# EAGLE schematic SteeringV2 - Archie (EAGLE 9.6.2)
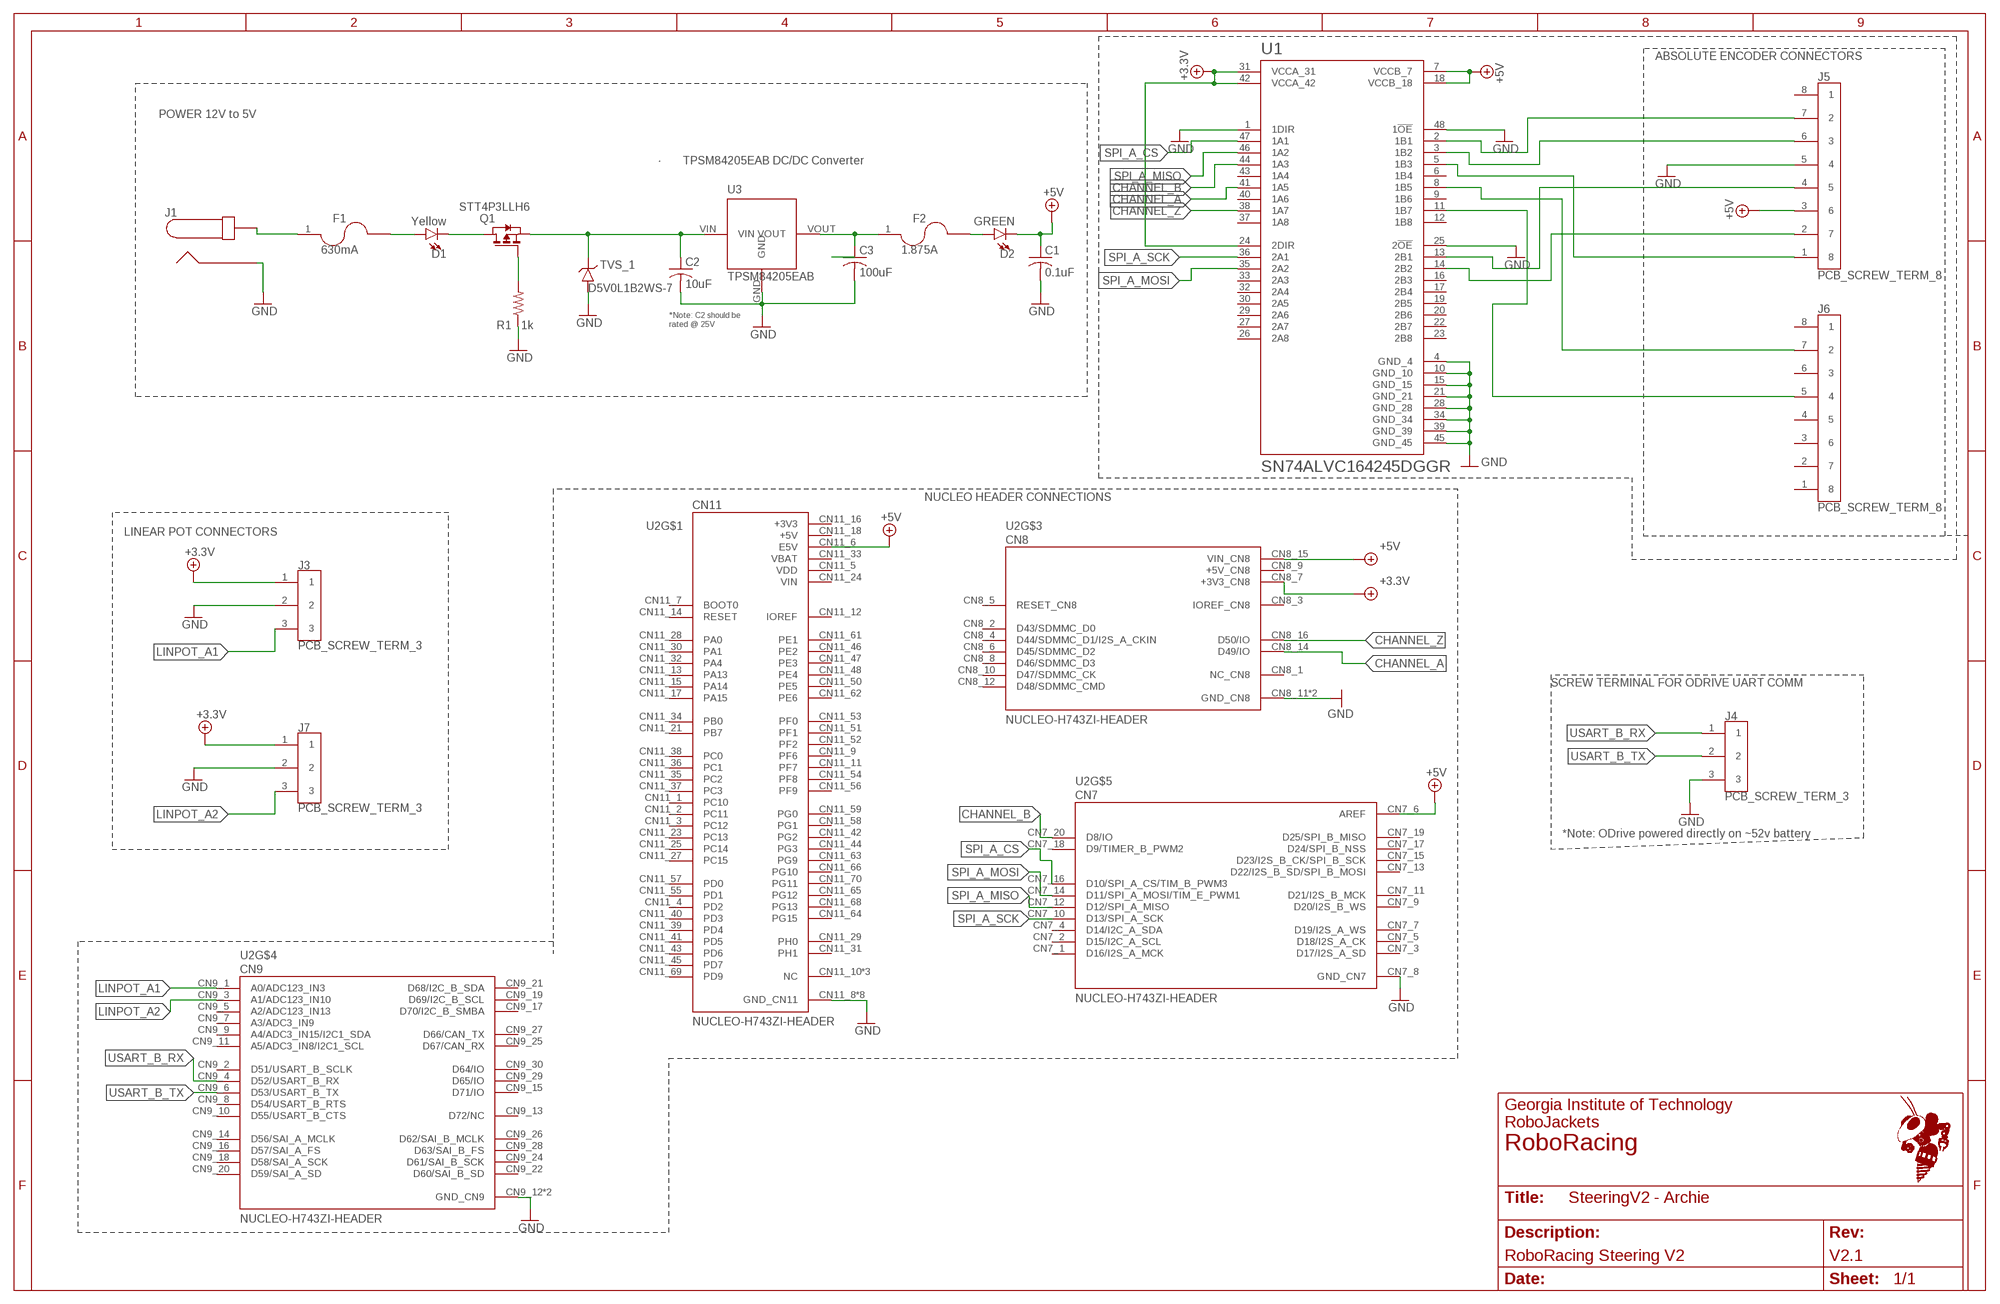
[diagram p0: schematic, sheet 1]
FRAME1 (FRAME_11_17): REVISION: V2.1; SCH_DESC: RoboRacing Steering V2; TEAM: RoboRacing

## Parts
C1  0.1uF  C-US025-024X044  [C025-024X044]
C2  10uF  C-US025-024X044  [C025-024X044]
C3  100uF  C-US025-024X044  [C025-024X044]
D1  Yellow  LED-YELLOW0603  [LED-0603]
D2  GREEN  LED-GREEN1206  [LED-1206]
F1  630mA  SMD_FUSE0603  [F0603]
F2  1.875A  SMD_FUSE0603  [F0603]
J1  PJ-037A  [PJ-037A]
J3  PCB_SCREW_TERM_3  [SCREW_TERMINAL_PCB_CONN_3_POLE]
J4  PCB_SCREW_TERM_3  [SCREW_TERMINAL_PCB_CONN_3_POLE]
J5  PCB_SCREW_TERM_8  [SCREW_TERMINAL_PCB_CONN_8_POLE]
J6  PCB_SCREW_TERM_8  [SCREW_TERMINAL_PCB_CONN_8_POLE]
J7  PCB_SCREW_TERM_3  [SCREW_TERMINAL_PCB_CONN_3_POLE]
Q1  STT4P3LLH6  [SOT23-6]
R1  1k  R-US_R0603  [R0603]
TVS_1  D5V0L1B2WS-7  [SOD-323]
U1  SN74ALVC164245DGGR  [SOP50P810X120-48N]
U2  NUCLEO-H743ZI-HEADER  [MODULE_NUCLEO-H743ZI]
U3  TPSM84205EAB  [TPSM84205EAB]

## Nets
5V_MAIN: C3.1 F2.1 U3.VOUT
+3.3V: J3.1 J7.1 U1.24(2DIR) U1.31(VCCA_31) U1.42(VCCA_42) U2.CN8_7(+3V3_CN8)
+5V: C1.1 D2.C J5.3 U1.7(VCCB_7) U1.18(VCCB_18) U2.CN7_6(AREF) U2.CN8_15(VIN_CN8) U2.CN11_6(E5V)
CHANNEL_A: J6.7 U1.8(1B5) U1.41(1A5) U2.CN8_14(D49/IO)
CHANNEL_B: J5.1 U1.5(1B3) U1.44(1A3) U2.CN7_20(D8/IO)
CHANNEL_Z: J6.5 U1.11(1B7) U1.38(1A7) U2.CN8_16(D50/IO)
GND: C1.2 C2.2 C3.2 J1.P$1 J3.2 J4.3 J5.5 J7.2 R1.1 TVS_1.A U1.1(1DIR) U1.4(GND_4) U1.10(GND_10) U1.15(GND_15) U1.21(GND_21) U1.25(2!OE) U1.28(GND_28) U1.34(GND_34) U1.39(GND_39) U1.45(GND_45) U1.48(1!OE) U2.CN7_8(GND_CN7) U2.CN8_11(GND_CN8) U2.CN8_13(GND_CN8) U2.CN9_12(GND_CN9) U2.CN9_23(GND_CN9) U2.CN11_8(GND_CN11) U2.CN11_19(GND_CN11) U2.CN11_20(GND_CN11) U2.CN11_22(GND_CN11) U2.CN11_49(GND_CN11) U2.CN11_60(GND_CN11) U2.CN11_71(GND_CN11) U2.CN11_72(GND_CN11) U3.GND
LINPOT_A1: J3.3 U2.CN9_1(A0/ADC123_IN3)
LINPOT_A2: J7.3 U2.CN9_3(A1/ADC123_IN10)
N$1: D1.A F1.2
N$2: Q1.3(G) R1.2
N$3: C2.1 Q1.4(S) TVS_1.C U3.VIN
N$4: F1.1 J1.P$2
N$6: D1.C Q1.1(D) Q1.2(D) Q1.5(D) Q1.6(D)
N$7: D2.A F2.2
SPI_A_CS: J5.7 U1.2(1B1) U1.47(1A1) U2.CN7_16(D10/SPI_A_CS/TIM_B_PWM3)
SPI_A_MISO: J5.6 U1.3(1B2) U1.46(1A2) U2.CN7_12(D12/SPI_A_MISO)
SPI_A_MOSI: J5.2 U1.14(2B2) U1.35(2A2) U2.CN7_14(D11/SPI_A_MOSI/TIM_E_PWM1)
SPI_A_SCK: J5.4 U1.13(2B1) U1.36(2A1) U2.CN7_10(D13/SPI_A_SCK)
USART_B_RX: J4.1 U2.CN9_4(D52/USART_B_RX)
USART_B_TX: J4.2 U2.CN9_6(D53/USART_B_TX)
Unconnected: J5.8 J6.1 J6.2 J6.3 J6.4 J6.6 J6.8 U1.6(1B4) U1.9(1B6) U1.12(1B8) U1.16(2B3) U1.17(2B4) U1.19(2B5) U1.20(2B6) U1.22(2B7) U1.23(2B8) U1.26(2A8) U1.27(2A7) U1.29(2A6) U1.30(2A5) U1.32(2A4) U1.33(2A3) U1.37(1A8) U1.40(1A6) U1.43(1A4) U2.CN7_1(D16/I2S_A_MCK) U2.CN7_2(D15/I2C_A_SCL) U2.CN7_3(D17/I2S_A_SD) U2.CN7_4(D14/I2C_A_SDA) U2.CN7_5(D18/I2S_A_CK) U2.CN7_7(D19/I2S_A_WS) U2.CN7_9(D20/I2S_B_WS) U2.CN7_11(D21/I2S_B_MCK) U2.CN7_13(D22/I2S_B_SD/SPI_B_MOSI) U2.CN7_15(D23/I2S_B_CK/SPI_B_SCK) U2.CN7_17(D24/SPI_B_NSS) U2.CN7_18(D9/TIMER_B_PWM2) U2.CN7_19(D25/SPI_B_MISO) U2.CN8_1(NC_CN8) U2.CN8_2(D43/SDMMC_D0) U2.CN8_3(IOREF_CN8) U2.CN8_4(D44/SDMMC_D1/I2S_A_CKIN) U2.CN8_5(RESET_CN8) U2.CN8_6(D45/SDMMC_D2) U2.CN8_8(D46/SDMMC_D3) U2.CN8_10(D47/SDMMC_CK) U2.CN8_12(D48/SDMMC_CMD) U2.CN9_2(D51/USART_B_SCLK) U2.CN9_5(A2/ADC123_IN13) U2.CN9_7(A3/ADC3_IN9) U2.CN9_8(D54/USART_B_RTS) U2.CN9_9(A4/ADC3_IN15/I2C1_SDA) U2.CN9_10(D55/USART_B_CTS) U2.CN9_11(A5/ADC3_IN8/I2C1_SCL) U2.CN9_13(D72/NC) U2.CN9_14(D56/SAI_A_MCLK) U2.CN9_15(D71/IO) U2.CN9_16(D57/SAI_A_FS) U2.CN9_17(D70/I2C_B_SMBA) U2.CN9_18(D58/SAI_A_SCK) U2.CN9_19(D69/I2C_B_SCL) U2.CN9_20(D59/SAI_A_SD) U2.CN9_21(D68/I2C_B_SDA) U2.CN9_22(D60/SAI_B_SD) U2.CN9_24(D61/SAI_B_SCK) U2.CN9_25(D67/CAN_RX) U2.CN9_26(D62/SAI_B_MCLK) U2.CN9_27(D66/CAN_TX) U2.CN9_28(D63/SAI_B_FS) U2.CN9_29(D65/IO) U2.CN9_30(D64/IO) U2.CN10_2(D7/IO) U2.CN10_4(D6/TIMER_A_PWM1) U2.CN10_6(D5/TIMER_A_PWM2) U2.CN10_7(A6/ADC_A_IN) U2.CN10_8(D4/IO) U2.CN10_9(A7/ADC_B_IN) U2.CN10_10(D3/TIMER_A_PWM3) U2.CN10_11(A8/ADC_C_IN) U2.CN10_12(D2/IO) U2.CN10_13(D26/IO) U2.CN10_14(D1/USART_A_TX) U2.CN10_15(D27/IO) U2.CN10_16(D0/USART_A_RX) U2.CN10_18(D42/TIMER_A_PWM1N) U2.CN10_19(D28/IO) U2.CN10_20(D41/TIMER_A_ETR) U2.CN10_21(D29/IO) U2.CN10_23(D30/IO) U2.CN10_24(D40/TIMER_A_PWM2N) U2.CN10_25(D31/IO) U2.CN10_26(D39/TIMER_A_PWM3N) U2.CN10_28(D38/IO) U2.CN10_29(D32/TIMER_C_PWM1) U2.CN10_30(D37/TIMER_A_BKIN1) U2.CN10_31(D33/TIMER_D_PWM1) U2.CN10_32(D36/TIMER_C_PWM2) U2.CN10_33(D34/TIMER_B_ETR) U2.CN10_34(D35/TIMER_C_PWM3) U2.CN11_1(PC10) U2.CN11_2(PC11) U2.CN11_3(PC12) U2.CN11_4(PD2) U2.CN11_7(BOOT0) U2.CN11_9(PF6) U2.CN11_10(NC) U2.CN11_11(PF7) U2.CN11_12(IOREF) U2.CN11_13(PA13) U2.CN11_14(RESET) U2.CN11_15(PA14) U2.CN11_17(PA15) U2.CN11_21(PB7) U2.CN11_23(PC13) U2.CN11_25(PC14) U2.CN11_26(NC) U2.CN11_27(PC15) U2.CN11_28(PA0) U2.CN11_29(PH0) U2.CN11_30(PA1) U2.CN11_31(PH1) U2.CN11_32(PA4) U2.CN11_34(PB0) U2.CN11_35(PC2) U2.CN11_36(PC1) U2.CN11_37(PC3) U2.CN11_38(PC0) U2.CN11_39(PD4) U2.CN11_40(PD3) U2.CN11_41(PD5) U2.CN11_42(PG2) U2.CN11_43(PD6) U2.CN11_44(PG3) U2.CN11_45(PD7) U2.CN11_46(PE2) U2.CN11_47(PE3) U2.CN11_48(PE4) U2.CN11_50(PE5) U2.CN11_51(PF1) U2.CN11_52(PF2) U2.CN11_53(PF0) U2.CN11_54(PF8) U2.CN11_55(PD1) U2.CN11_56(PF9) U2.CN11_57(PD0) U2.CN11_58(PG1) U2.CN11_59(PG0) U2.CN11_61(PE1) U2.CN11_62(PE6) U2.CN11_63(PG9) U2.CN11_64(PG15) U2.CN11_65(PG12) U2.CN11_66(PG10) U2.CN11_67(NC) U2.CN11_68(PG13) U2.CN11_69(PD9) U2.CN11_70(PG11) U2.CN12_1(PC9) U2.CN12_2(PC8) U2.CN12_3(PB8) U2.CN12_4(PC6) U2.CN12_5(PB9) U2.CN12_6(PC5) U2.CN12_10(PD8) U2.CN12_11(PA5) U2.CN12_12(PA12) U2.CN12_13(PA6) U2.CN12_14(PA11) U2.CN12_15(PA7) U2.CN12_16(PB12) U2.CN12_17(PB6) U2.CN12_18(PB11) U2.CN12_19(PC7) U2.CN12_21(PA9) U2.CN12_22(PB2) U2.CN12_23(PA8) U2.CN12_24(PB1) U2.CN12_25(PB10) U2.CN12_26(PB15) U2.CN12_27(PB4) U2.CN12_28(PB14) U2.CN12_29(PB5) U2.CN12_30(PB13) U2.CN12_31(PB3) U2.CN12_33(PA10) U2.CN12_34(PC4) U2.CN12_35(PA2) U2.CN12_36(PF5) U2.CN12_37(PA3) U2.CN12_38(PF4) U2.CN12_40(PE8) U2.CN12_41(PD13) U2.CN12_42(PF10) U2.CN12_43(PD12) U2.CN12_44(PE7) U2.CN12_45(PD11) U2.CN12_46(PD14) U2.CN12_47(PE10) U2.CN12_48(PD15) U2.CN12_49(PE12) U2.CN12_50(PF14) U2.CN12_51(PE14) U2.CN12_52(PE9) U2.CN12_53(PE15) U2.CN12_55(PE13) U2.CN12_56(PE11) U2.CN12_57(PF13) U2.CN12_58(PF3) U2.CN12_59(PF12) U2.CN12_60(PF15) U2.CN12_61(PG14) U2.CN12_62(PF11) U2.CN12_64(PE0) U2.CN12_65(PD10) U2.CN12_66(PG8) U2.CN12_67(PG7) U2.CN12_68(PG5) U2.CN12_69(PG4) U2.CN12_70(PG6)

## Notes on the sheet
- ABSOLUTE ENCODER CONNECTORS
- POWER 12V to 5V
- ·       TPSM84205EAB DC/DC Converter
- *Note: C2 should be
  rated @ 25V
- NUCLEO HEADER CONNECTIONS
- LINEAR POT CONNECTORS
- SCREW TERMINAL FOR ODRIVE UART COMM
- *Note: ODrive powered directly on ~52v battery

## Power pins joined to a net without a drawn wire
+3V3: U2.CN11_16(+3V3)
+5V: U2.CN11_18(+5V)
+5V_CN8: U2.CN8_9(+5V_CN8)
AGND_CN10: U2.CN10_3(AGND_CN10)
AGND_CN12: U2.CN12_32(AGND_CN12)
AVDD_CN10: U2.CN10_1(AVDD_CN10)
AVDD_CN12: U2.CN12_7(AVDD_CN12)
GND_CN10: U2.CN10_5(GND_CN10) U2.CN10_17(GND_CN10) U2.CN10_22(GND_CN10) U2.CN10_27(GND_CN10)
GND_CN12: U2.CN12_9(GND_CN12) U2.CN12_20(GND_CN12) U2.CN12_39(GND_CN12) U2.CN12_54(GND_CN12) U2.CN12_63(GND_CN12) U2.CN12_71(GND_CN12) U2.CN12_72(GND_CN12)
U5V: U2.CN12_8(U5V)
VBAT: U2.CN11_33(VBAT)
VDD: U2.CN11_5(VDD)
VIN: U2.CN11_24(VIN)

## Library data of the parts
C1-C3 = rcl:C-US: CAPACITOR, American symbol; SPICEPREFIX: C
D1 = RoboJackets-LEDs:LED-YELLOW: Yellow SMD LED Used in manufacturing several products at SparkFun. Packages: 0603 - SMD 0603 package[Product Link] <http://www.kingbrightusa.com/product.asp?catalog_name=LED&product_id=APT1608SYCK> 0603 -SMART - SMART SMD 0603 package (more efficient/more expensive) [Product Link] <http://www.osram-os.com/osram_os/en/products/product-catalog/led-light-emitting-diodes/smartled-0603/ly-l29k/index.jsp> LilyPad - SMD1206 package[Product Datasheet] <https://www.sparkfun.com/datasheets/DevTools/LilyPad/Q150YUS4.pdf> SparkFun Products: Blynk Board <https://www.sparkfun.com/products/13794> IOIO-OTG <https://www.sparkfun.com/products/13613> XBee Explorer Serial <https://www.sparkfun.com/products/13225>; PROD_ID: DIO-09003
D2 = RoboJackets-LEDs:LED-GREEN: Green SMD LED Used in manufacturing of various products at SparkFun Packages: 0603 - SMD 0603 package [Product Link] <http://www.futureelectronics.com/en/technologies/semiconductors/optoelectronics/leds/Pages/9894312-LTST-C190GKT.aspx?CrossPart=HSMG-C190&IM=0> LilyPad 1206 - SMD1206 LilyPad package [Product Link] <http://www.futureelectronics.com/en/Technologies/Product.aspx?ProductID=IN150NGHARVATEKCORPORATION2049943&IM=0> 1206 - SMD1206 package [Product Link] <http://www.futureelectronics.com/en/technologies/semiconductors/optoelectronics/leds/Pages/8315665-LTST-C150KGKT.aspx?IM=0> 1206 Bottom Mount -SMD 1206 Bottom Mount [Product Link] <http://www.digikey.com/product-detail/en/lite-on-inc/LTST-C230KGKT/160-1456-1-ND/386854> SparkFun Products: Pro Mini 328 -5V <https://www.sparkfun.com/products/821> RedBoard <https://www.sparkfun.com/products/12757> MP3 Trigger <https://www.sparkfun.com/products/13720> Makey Makey <https://www.sparkfun.com/products/11076>; PROD_ID: DIO-00862
F1 F2 = RoboJackets-Fuses:SMD_FUSE: Generic part for SMD fuses
J1 = RoboJackets-Connectors:PJ-037A*: Description: Power Barrel Connector Jack 2.10mm ID (0.083"), 5.50mm OD (0.217") Through Hole, Right Angle Link 2.5A: Digi-Key <https://www.digikey.com/products/en?keywords=CP-037A-ND> Link 5A: Digi-Key <https://www.digikey.com/product-detail/en/cui-devices/PJ-037AH/CP-037AH-ND/1644547>; DKPN: CP-037A-ND
J3 J4 J7 = RoboJackets-Connectors:PCB_SCREW_TERM_3; DKPT: 732-2770-ND
J5 J6 = RoboJackets-Connectors:PCB_SCREW_TERM_8; DKPT: 732-2774-ND
Q1 = RoboJackets-Discrete:STT4P3LLH6: MOSFET P-CH 30V 4A SOT23-6 Datasheet <https://www.st.com/content/ccc/resource/technical/document/datasheet/13/e4/a1/65/8b/79/44/73/DM00084060.pdf/files/DM00084060.pdf/jcr:content/translations/en.DM00084060.pdf>; DKPN: 497-15521-1-ND
R1 = rcl:R-US_: RESISTOR, American symbol; SPICEPREFIX: R
TVS_1 = RoboJackets-Diodes:D5V0L1B2WS-7: TVS 5V Diode Datasheet <https://www.diodes.com/assets/Datasheets/D5V0L1B2WS.pdf>; DKPN: D5V0L1B2WS-7DICT-ND
U1 = RoboRacing_STM:SN74ALVC164245DGGR: 16-Bit 2.5-V to 3.3-V/3.3-V To 5-V Level Shifting Transceiver With 3-State Outputs 48-TSSOP -40 to 85; MANUFACTURER: Texas Instruments; MAXIMUM_PACKAGE_HEIGHT: 1.20 mm; PARTREV: Q; STANDARD: IPC-7351B
U2 = RoboRacing_STM:NUCLEO-H743ZI-HEADER: STM32F429ZI, mbed-Enabled Development Nucleo-144 STM32F4 ARM® Cortex®-M4 MCU 32-Bit Embedded Evaluation Board; MANUFACTURER: STMicroelectronics; MAXIMUM_PACKAGE_HEIGHT: N/A; PARTREV: 8; STANDARD: Manufacturer Recommendations
U3 = RoboRacing_STM:TPSM84205EAB: 1.5A, 28V Input, 5V Output Power Module https://www.ti.com/lit/ds/symlink/tpsm84205.pdf?ts=1642464100890&ref_url=https%253A%252F%252Fwww.ti.com%252Fstore%252Fti%252Fen%252Fp%252Fproduct%252F%253Fp%253DTPSM84205EAB; DKPN: 296-47074-ND